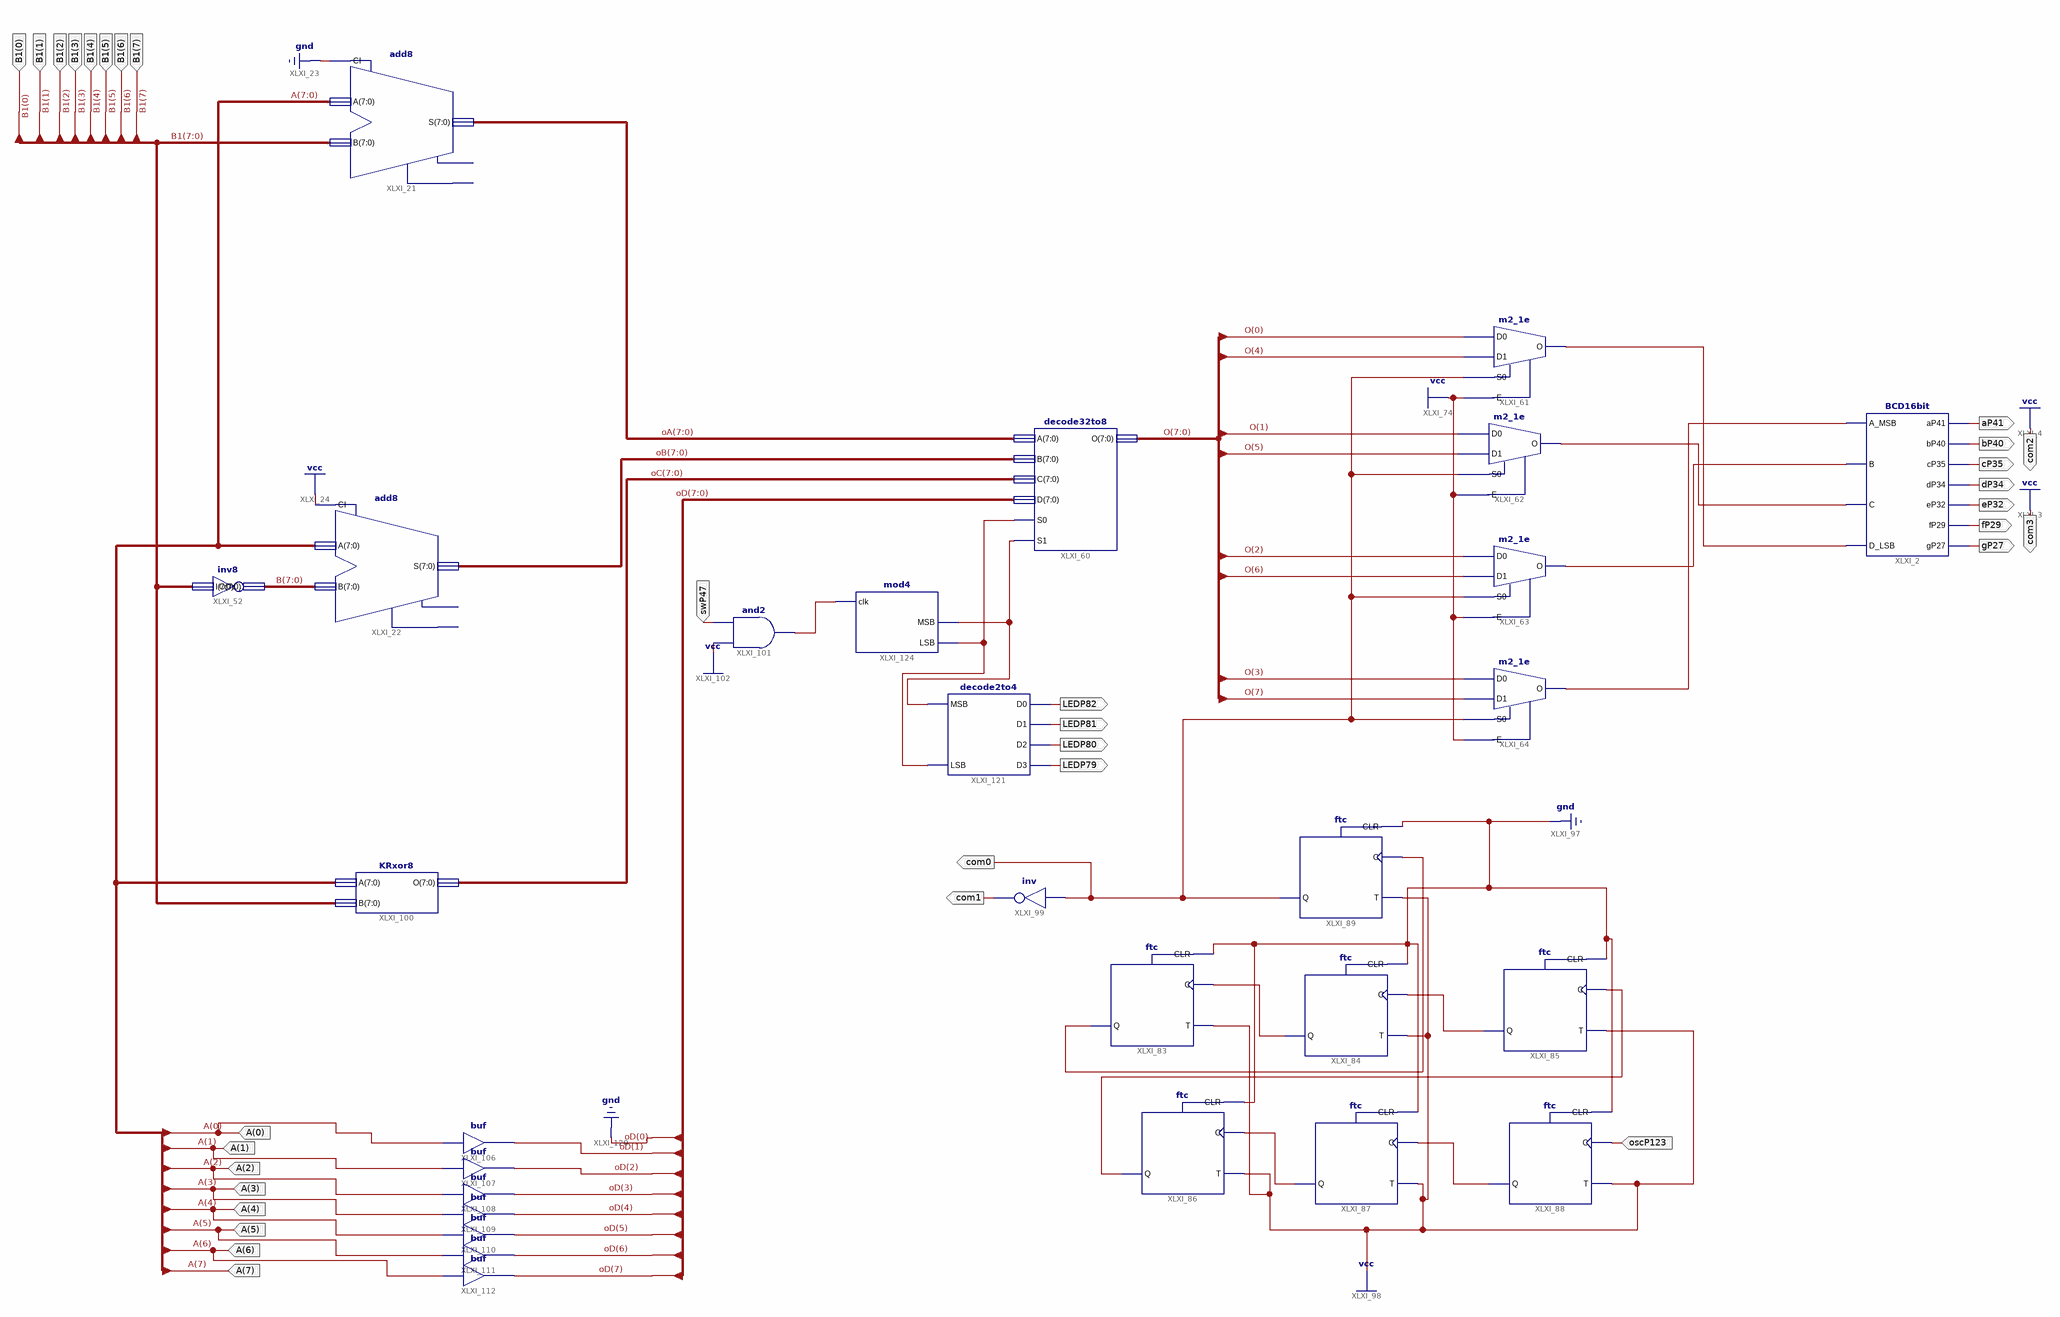
[diagram p0: schematic sheet 1]
// Xilinx ISE schematic lab9.sch (spartan6) as structural Verilog: 28 symbols, 33 ports
module lab9 (
  input  [7:0] A,
  input  [7:0] B1,
  input  oscP123,
  input  swP47,
  output aP41,
  output bP40,
  output cP35,
  output dP34,
  output eP32,
  output fP29,
  output gP27,
  output com3,
  output com2,
  output com0,
  output com1,
  output LEDP82,
  output LEDP81,
  output LEDP80,
  output LEDP79
);

  wire XLXN_100, XLXN_101, XLXN_111, XLXN_115, XLXN_116, XLXN_117, XLXN_126, XLXN_127, XLXN_128, XLXN_129,
       XLXN_130, XLXN_131, XLXN_144;
  wire [7:0] B, O, oA, oB, oC;
  wire [7:1] oD;

  add8 XLXI_22 (.A(A), .B(B), .CI(1'b1), .S(oB));  // open: CO, OFL
  add8 XLXI_21 (.A(A), .B(B1), .CI(1'b0), .S(oA));  // open: CO, OFL
  inv8 XLXI_52 (.I(B1), .O(B));
  m2_1e XLXI_61 (.D0(O[0]), .D1(O[4]), .E(1'b1), .S0(com0), .O(XLXN_111));
  m2_1e XLXI_64 (.D0(O[3]), .D1(O[7]), .E(1'b1), .S0(com0), .O(XLXN_117));
  m2_1e XLXI_63 (.D0(O[2]), .D1(O[6]), .E(1'b1), .S0(com0), .O(XLXN_116));
  m2_1e XLXI_62 (.D0(O[1]), .D1(O[5]), .E(1'b1), .S0(com0), .O(XLXN_115));
  decode32to8 XLXI_60 (.A(oA), .B(oB), .C(oC), .D({oD, 1'b0}), .S0(XLXN_101), .S1(XLXN_100), .O(O));
  BCD16bit XLXI_2 (
    .A_MSB(XLXN_117), .C(XLXN_115), .aP41(aP41), .bP40(bP40), .cP35(cP35), .dP34(dP34), .eP32(eP32),
    .fP29(fP29), .gP27(gP27), .B(XLXN_116), .D_LSB(XLXN_111));
  ftc XLXI_83 (.C(XLXN_130), .CLR(1'b0), .T(1'b1), .Q(XLXN_131));
  ftc XLXI_84 (.C(XLXN_129), .CLR(1'b0), .T(1'b1), .Q(XLXN_130));
  ftc XLXI_85 (.C(XLXN_128), .CLR(1'b0), .T(1'b1), .Q(XLXN_129));
  ftc XLXI_86 (.C(XLXN_127), .CLR(1'b0), .T(1'b1), .Q(XLXN_128));
  ftc XLXI_87 (.C(XLXN_126), .CLR(1'b0), .T(1'b1), .Q(XLXN_127));
  ftc XLXI_88 (.C(oscP123), .CLR(1'b0), .T(1'b1), .Q(XLXN_126));
  ftc XLXI_89 (.C(XLXN_131), .CLR(1'b0), .T(1'b1), .Q(com0));
  not XLXI_99 (com1, com0);
  KRxor8 XLXI_100 (.A(A), .B(B1), .O(oC));
  and XLXI_101 (XLXN_144, 1'b1, swP47);
  buf XLXI_106 (oD[1], A[0]);
  buf XLXI_107 (oD[2], A[1]);
  buf XLXI_108 (oD[3], A[2]);
  buf XLXI_109 (oD[4], A[3]);
  buf XLXI_110 (oD[5], A[4]);
  buf XLXI_111 (oD[6], A[5]);
  buf XLXI_112 (oD[7], A[6]);
  decode2to4 XLXI_121 (.LSB(XLXN_101), .MSB(XLXN_100), .D0(LEDP82), .D1(LEDP81), .D2(LEDP80), .D3(LEDP79));
  mod4 XLXI_124 (.clk(XLXN_144), .MSB(XLXN_100), .LSB(XLXN_101));

  assign com2 = 1'b1;
  assign com3 = 1'b1;
endmodule
